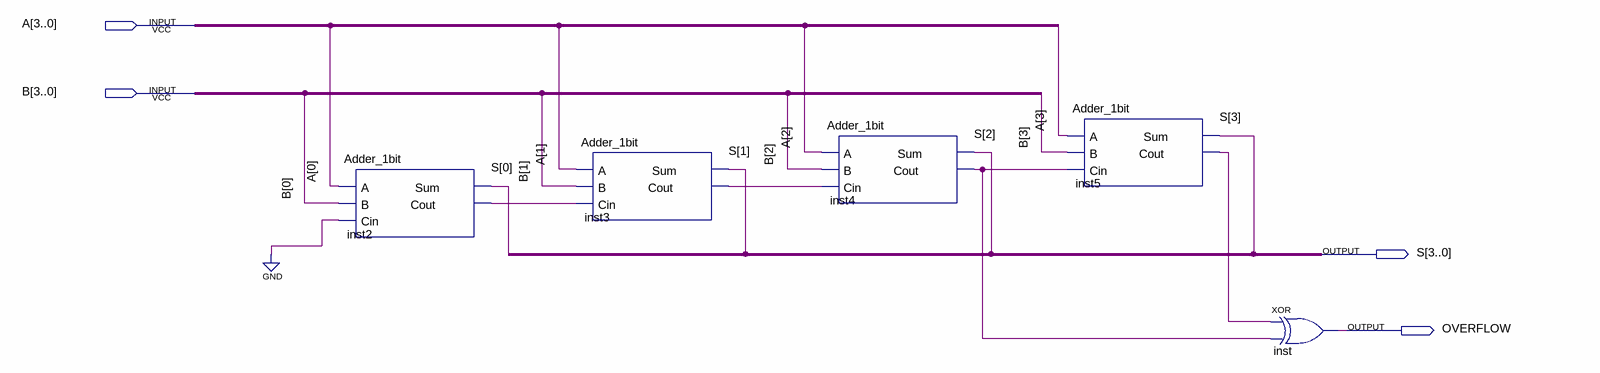
[diagram p0: schematic sheet]
// Quartus schematic FA4bit.bdf as structural Verilog: 5 symbols, 4 pins
module FA4bit (
  input  [3:0] A,
  input  [3:0] B,
  output [3:0] S,
  output OVERFLOW
);

  wire inst2_cout, inst3_cout, inst4_cout, inst5_cout;

  Adder_1bit inst2 (.A(A[0]), .B(B[0]), .Cin(1'b0), .Sum(S[0]), .Cout(inst2_cout));
  Adder_1bit inst3 (.A(A[1]), .B(B[1]), .Cin(inst2_cout), .Sum(S[1]), .Cout(inst3_cout));
  Adder_1bit inst4 (.A(A[2]), .B(B[2]), .Cin(inst3_cout), .Sum(S[2]), .Cout(inst4_cout));
  Adder_1bit inst5 (.A(A[3]), .B(B[3]), .Cin(inst4_cout), .Sum(S[3]), .Cout(inst5_cout));
  xor inst (OVERFLOW, inst5_cout, inst4_cout);
endmodule
